# EAGLE design P6 LED SHIELD (EAGLE 7.3.0)
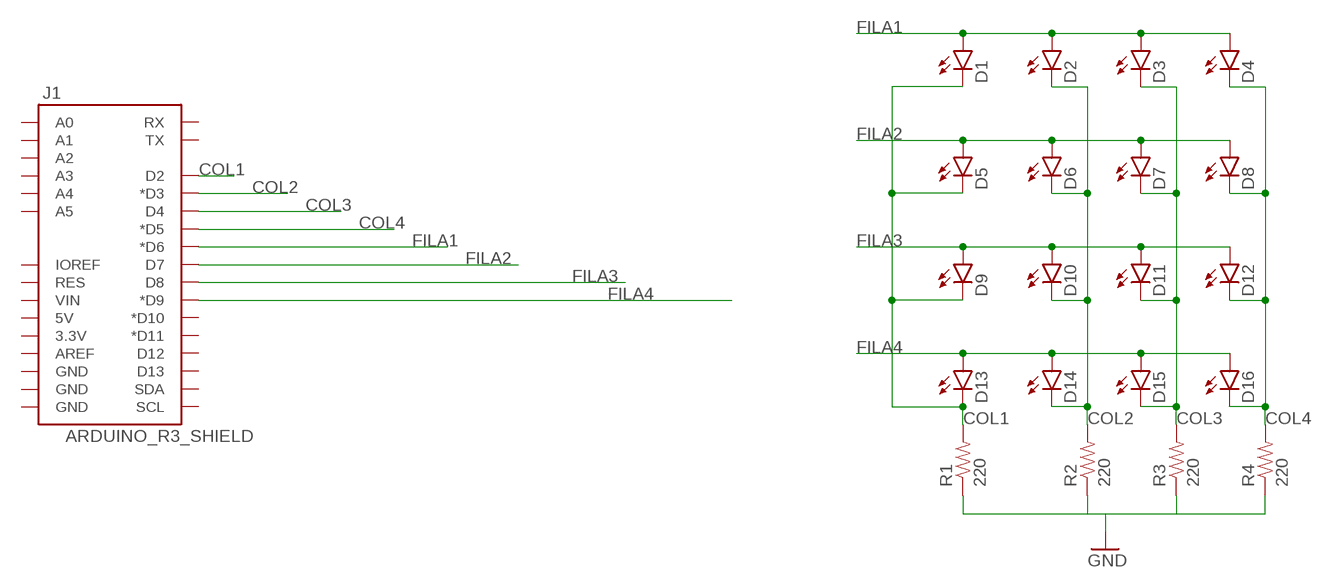
[diagram p0: schematic, sheet 1]

## Parts
D1  LED5MM  [LED5MM]
D2  LED5MM  [LED5MM]
D3  LED5MM  [LED5MM]
D4  LED5MM  [LED5MM]
D5  LED5MM  [LED5MM]
D6  LED5MM  [LED5MM]
D7  LED5MM  [LED5MM]
D8  LED5MM  [LED5MM]
D9  LED5MM  [LED5MM]
D10  LED5MM  [LED5MM]
D11  LED5MM  [LED5MM]
D12  LED5MM  [LED5MM]
D13  LED5MM  [LED5MM]
D14  LED5MM  [LED5MM]
D15  LED5MM  [LED5MM]
D16  LED5MM  [LED5MM]
J1  ARDUINO_R3_SHIELD  [UNO_R3_SHIELD]
R1  220  RESISTORPTH-1/4W  [AXIAL-0.4]
R2  220  RESISTORPTH-1/4W  [AXIAL-0.4]
R3  220  RESISTORPTH-1/4W  [AXIAL-0.4]
R4  220  RESISTORPTH-1/4W  [AXIAL-0.4]

## Nets
COL1: D1.K(C) D5.K(C) D9.K(C) D13.K(C) J1.D2 R1.P$2
COL2: D2.K(C) D6.K(C) D10.K(C) D14.K(C) J1.D3(*D3) R2.P$2
COL3: D3.K(C) D7.K(C) D11.K(C) D15.K(C) J1.D4 R3.P$2
COL4: D4.K(C) D8.K(C) D12.K(C) D16.K(C) J1.D5(*D5) R4.P$2
FILA1: D1.A D2.A D3.A D4.A J1.D6(*D6)
FILA2: D5.A D6.A D7.A D8.A J1.D7
FILA3: D9.A D10.A D11.A D12.A J1.D8
FILA4: D13.A D14.A D15.A D16.A J1.D9(*D9)
GND: R1.P$1 R2.P$1 R3.P$1 R4.P$1
Unconnected: J1.3.3V J1.5V J1.A0 J1.A1 J1.A2 J1.A3 J1.A4 J1.A5 J1.AREF J1.D10(*D10) J1.D11(*D11) J1.D12 J1.D13 J1.GND@0(GND) J1.GND@1(GND) J1.GND@2(GND) J1.IOREF J1.RES J1.RX J1.SCL J1.SDA J1.TX J1.VIN

## Library data of the parts
D1-D16 = SparkFun-LED:LED: LEDs Standard schematic elements and footprints for 5mm, 3mm, 1206, and 0603 sized LEDs. 5mm - Spark Fun Electronics SKU : COM-00529 (and others)
J1 = SparkFun-Boards:ARDUINO_R3_SHIELD: Shield form compatible with the Arduino Uno R3.
R1-R4 = SparkFun-Resistors:RESISTOR: Resistor Basic schematic elements and footprints for 0603, 1206, and PTH resistors.

## Board
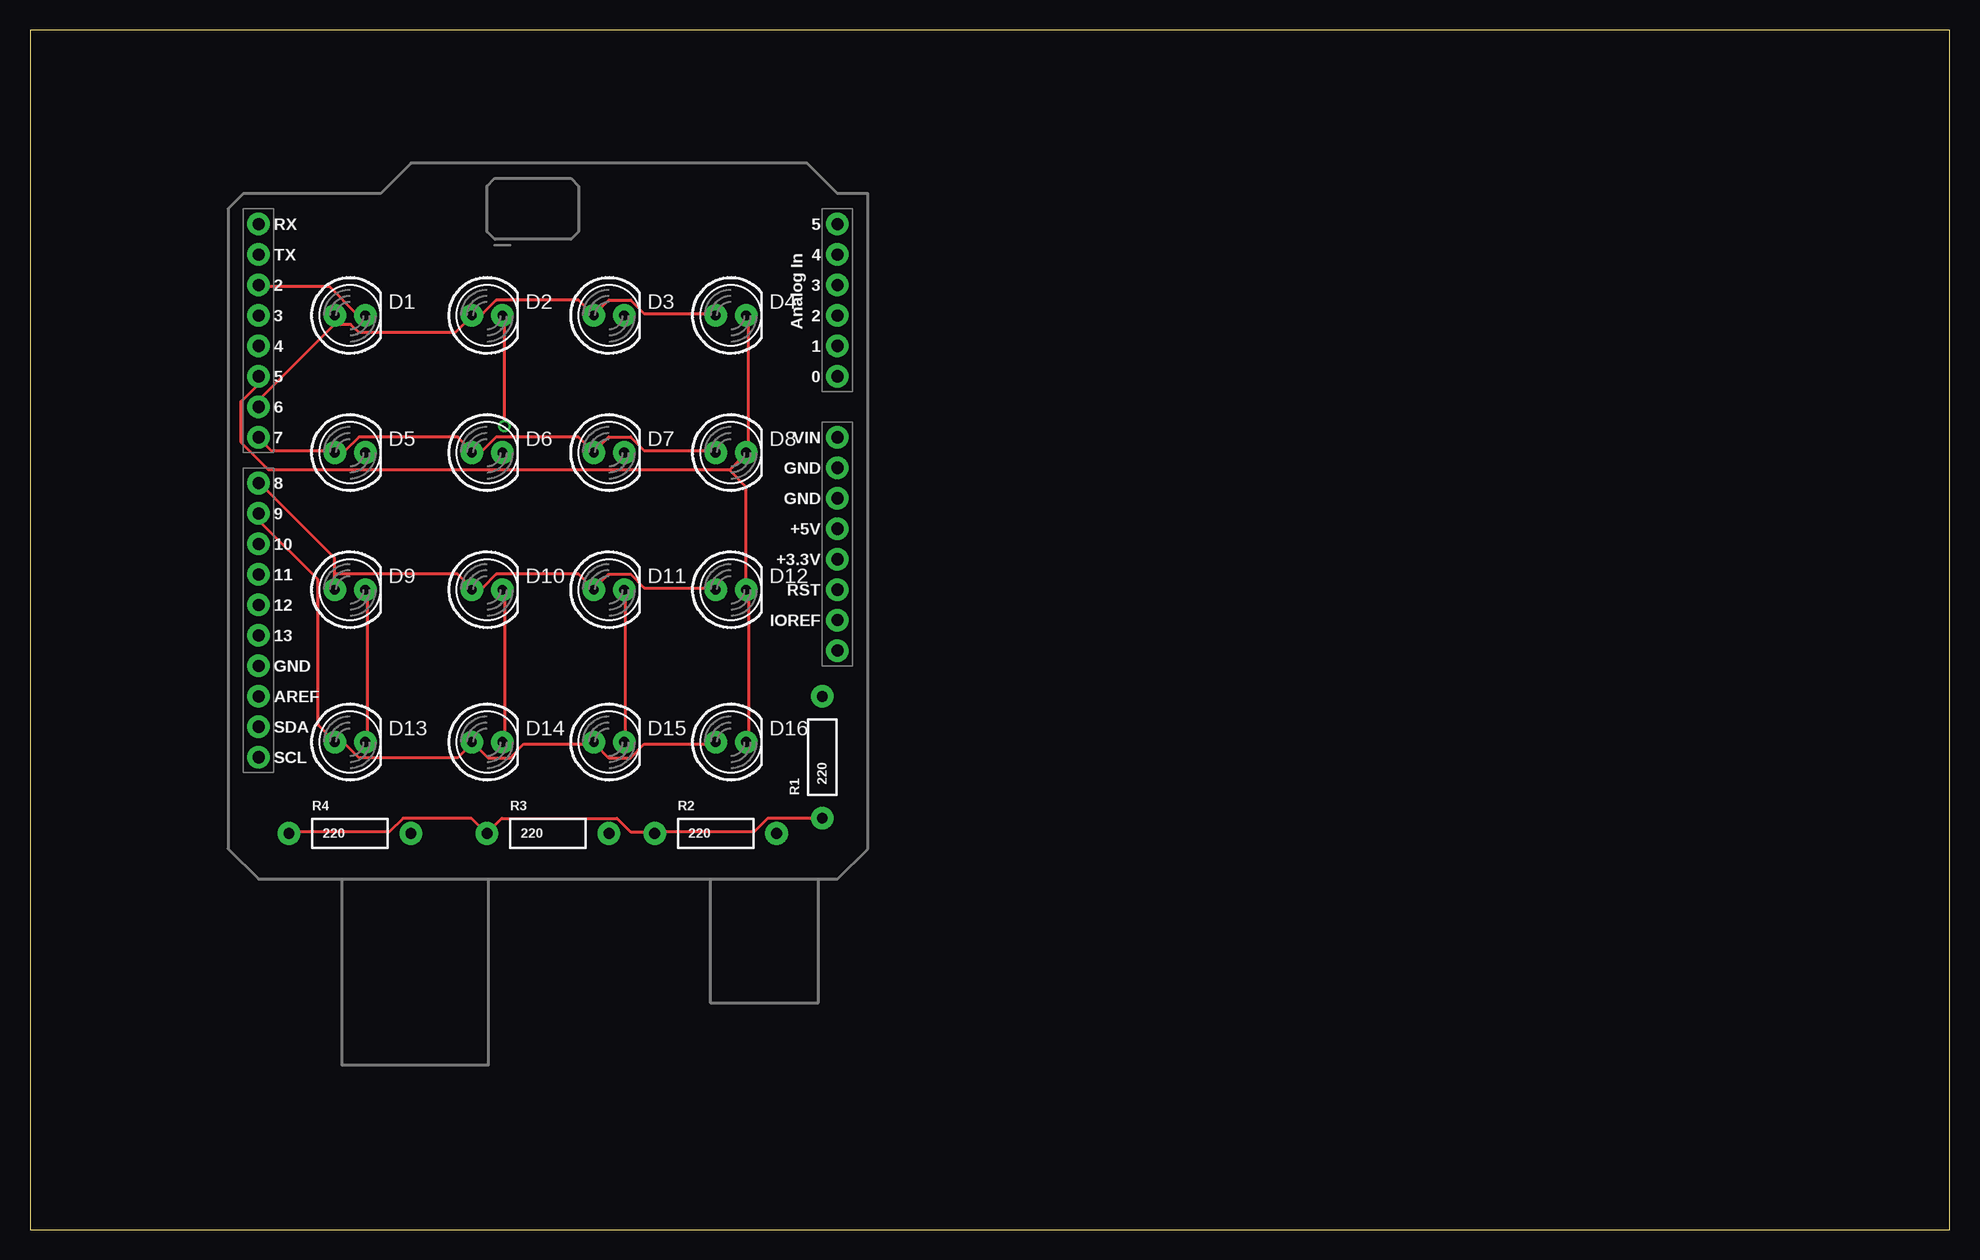
[diagram p1: board, top side]
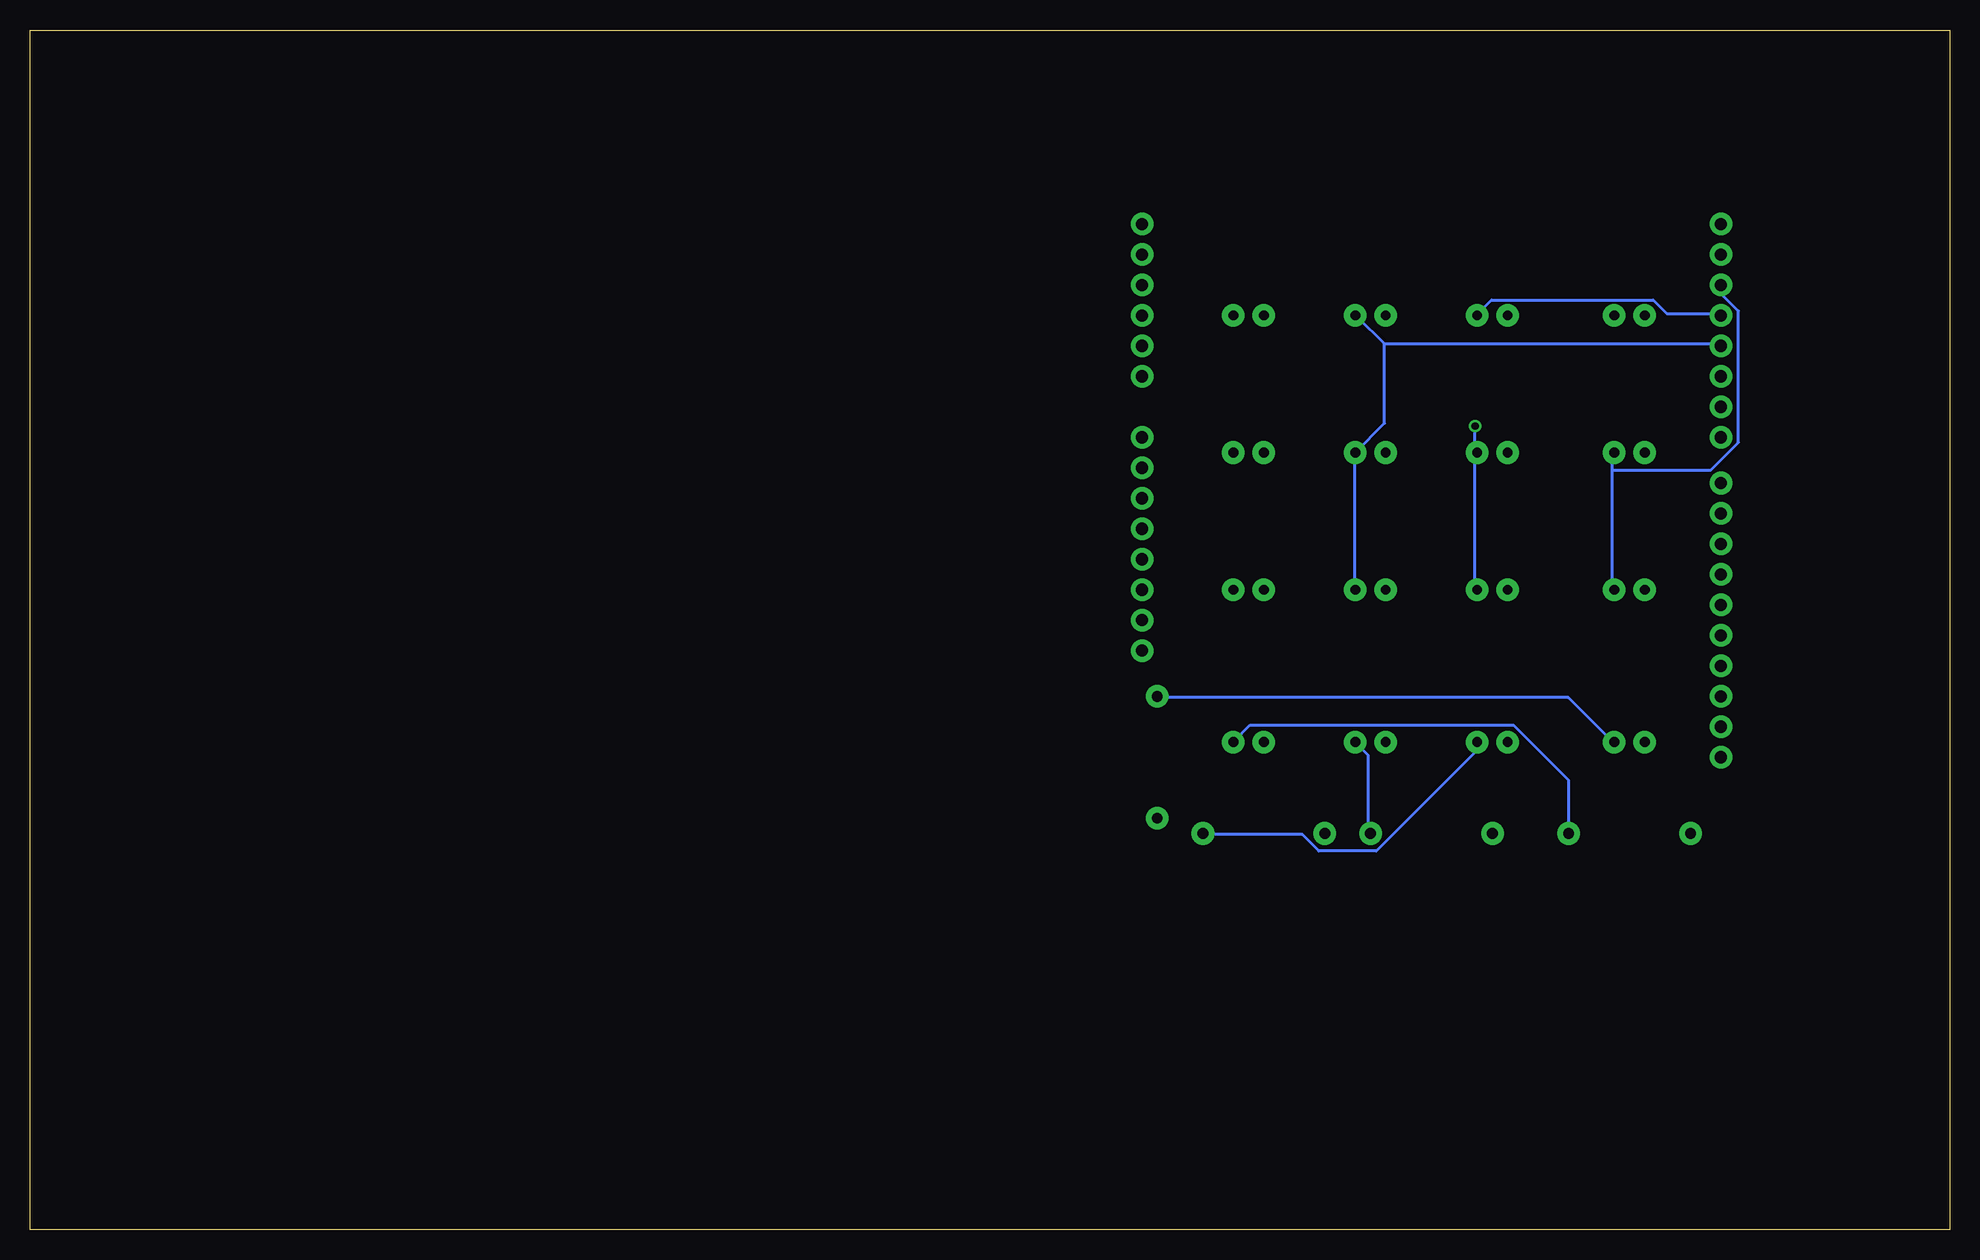
[diagram p2: board, bottom side, seen from below]

Size 160 x 100 mm. Coordinates in mm from the lower left corner, seen from the top.
Outline: 0,0 160,0 160,100 0,100 0,0
Copper layers (1*16): Top 0.035mm / dielectric 1.5mm / Bottom 0.035mm
Design rules "default": minimum track width 10mil, minimum drill 24mil, track to track 8mil, track to pad 8mil, pad to pad 8mil, via to via 8mil, smd to smd 8mil, copper to edge 40mil, drill to drill 8mil, minimum pad ring 10mil, minimum via ring 8mil, stop-mask expansion 4mil, vias tented up to drill 0mil, thermal gap 10mil

### Footprints (pad centres in the part's own frame; a part is rotated, then mirrored left to right if it is on the bottom)
LED5MM = drill 0.813 pad 1.88: A -1.27,0; K 1.27,0
UNO_R3_SHIELD = drill 1.016 pad 1.88: 3.3V 50.8,26.67; 5V 50.8,29.21; A0 50.8,41.91; A1 50.8,44.45; A2 50.8,46.99; A3 50.8,49.53; A4 50.8,52.07; A5 50.8,54.61; AREF 2.54,15.24; D2 2.54,49.53; D3 2.54,46.99; D4 2.54,44.45; D5 2.54,41.91; D6 2.54,39.37; D7 2.54,36.83; D8 2.54,33.02; D9 2.54,30.48; D10 2.54,27.94; D11 2.54,25.4; D12 2.54,22.86; D13 2.54,20.32; GND@0 50.8,31.75; GND@1 50.8,34.29; GND@2 2.54,17.78; IOREF 50.8,21.59; NC 50.8,19.05; RES 50.8,24.13; RX 2.54,54.61; SCL 2.54,10.16; SDA 2.54,12.7; TX 2.54,52.07; VIN 50.8,36.83
AXIAL-0.4 = drill 0.9 pad 1.88: P$1 -5.08,0; P$2 5.08,0

### Placement (x,y rotation side)
D1  26.67,76.2 0 top
D2  38.1,76.2 0 top
D3  48.26,76.2 0 top
D4  58.42,76.2 0 top
D5  26.67,64.77 0 top
D6  38.1,64.77 0 top
D7  48.26,64.77 0 top
D8  58.42,64.77 0 top
D9  26.67,53.34 0 top
D10  38.1,53.34 0 top
D11  48.26,53.34 0 top
D12  58.42,53.34 0 top
D13  26.67,40.64 0 top
D14  38.1,40.64 0 top
D15  48.26,40.64 0 top
D16  58.42,40.64 0 top
J1  16.51,29.21 0 top
R1  66.04,39.37 90 top
R2  57.15,33.02 0 top
R3  43.18,33.02 0 top
R4  26.67,33.02 0 top

### Tracks (layer width: path | path; a pad name or v marks a point on that pad's centre or on a via)
COL1
  Top 0.254: D1.K 27.89,76.35 27.2,76.35 24.92,78.64 19.2,78.64 J1.D2 | D13.K 28.12,40.69 28.12,53.26 D9.K
  Bottom 0.254: 28.12,63.32 28.12,53.49 D9.K | 28.12,63.32 28.12,64.69 D5.K | R1.P$2 65.84,44.35 31.77,44.35 28.12,40.69 D13.K | 28.12,63.32 19.89,63.32 17.6,65.61 17.6,76.58 18.97,77.95 18.97,78.64 J1.D2
COL2  (via drill 0.61)
  Top 0.254: D14.K 39.55,40.69 39.55,53.26 D10.K | v39.55,66.98 39.55,76.12 D2.K
  Bottom 0.254: J1.D3 19.2,76.35 23.55,76.35 24.69,77.5 38.18,77.5 39.32,76.35 D2.K | R2.P$2 62.18,32.92 53.95,32.92 52.58,31.55 47.78,31.55 39.55,39.78 39.55,40.46 D14.K | D10.K 39.55,53.49 39.55,64.69 D6.K 39.55,64.92 v39.55,66.98
COL3
  Top 0.254: D15.K 49.61,40.69 49.61,53.26 D11.K
  Bottom 0.254: 47.09,73.84 19.2,73.84 J1.D4 | 47.09,73.84 49.38,76.12 D3.K | R3.P$2 48.46,33.15 48.46,39.55 49.38,40.46 D15.K | D11.K 49.61,53.49 49.61,64.69 D7.K 47.09,67.21 47.09,73.84
COL4
  Top 0.254: 58.29,63.32 19.89,63.32 17.6,65.61 17.6,69.04 18.97,70.41 18.97,71.09 J1.D5 | 58.29,63.32 59.66,64.69 D8.K 59.89,64.92 59.89,76.12 D4.K | 58.29,63.32 59.66,61.95 59.66,53.49 D12.K 59.89,53.26 59.89,40.69 D16.K
  Bottom 0.254: R4.P$2 31.77,33.15 31.77,37.49 36.35,42.06 58.29,42.06 59.66,40.69 D16.K
FILA1
  Top 0.254: 25.38,75.44 19.2,69.27 19.2,68.58 J1.D6 | 25.38,75.44 25.38,76.12 D1.A 25.38,75.44 | D4.A 57.15,76.35 51.21,76.35 50.06,77.5 48.23,77.5 47.09,76.35 D3.A 46.86,76.35 45.72,77.5 38.86,77.5 37.72,76.35 37.03,76.35 D2.A 36.8,76.12 35.43,74.75 27.43,74.75 26.75,75.44 25.38,75.44
FILA2
  Top 0.254: J1.D7 19.2,65.84 20.12,64.92 25.38,64.92 D5.A 25.6,64.92 26.29,64.92 27.43,66.06 35.66,66.06 36.8,64.92 D6.A 37.03,64.92 37.72,64.92 38.86,66.06 45.72,66.06 46.86,64.92 D7.A 47.09,64.92 48.23,66.06 50.06,66.06 51.21,64.92 57.15,64.92 D8.A
FILA3
  Top 0.254: 25.38,54.63 25.38,56.01 19.2,62.18 J1.D8 | 25.38,54.63 25.38,53.49 D9.A | D12.A 57.15,53.49 51.21,53.49 50.06,54.63 48.23,54.63 47.09,53.49 D11.A 46.86,53.49 45.72,54.63 38.86,54.63 37.72,53.49 37.03,53.49 D10.A 36.8,53.49 35.66,54.63 25.38,54.63
FILA4
  Top 0.254: J1.D9 19.2,59.66 19.2,58.98 24,54.18 24,42.06 25.38,40.69 D13.A 25.6,40.46 26.29,40.46 27.43,39.32 35.66,39.32 36.8,40.46 D14.A 37.03,40.46 38.18,39.32 40.01,39.32 41.15,40.46 46.86,40.46 D15.A 47.09,40.46 48.23,39.32 50.06,39.32 51.21,40.46 57.15,40.46 D16.A
GND
  Top 0.254: R1.P$1 61.49,34.29 60.35,33.15 52.12,33.15 R2.P$1 51.89,33.15 50.06,33.15 48.92,34.29 39.32,34.29 38.18,33.15 R3.P$1 37.95,33.15 36.8,34.29 31.09,34.29 29.95,33.15 21.72,33.15 R4.P$1